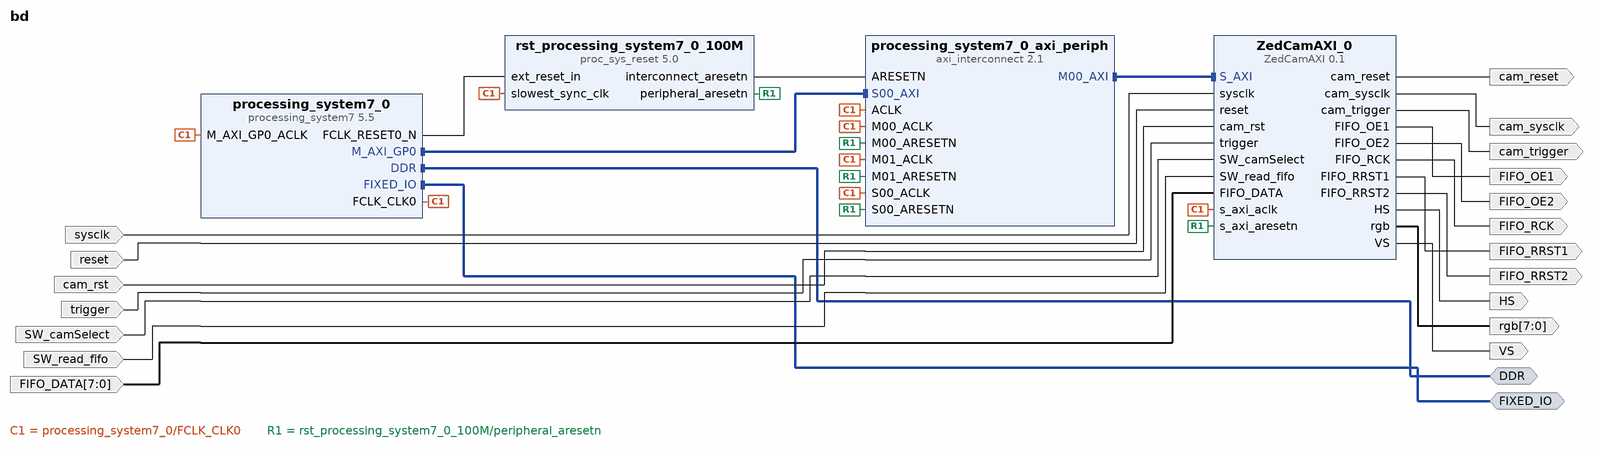
[diagram p0: block diagram of the top level]
# Vivado block design bd, Vivado 2016.2
create_bd_design bd

create_bd_intf_port -mode Master -vlnv xilinx.com:interface:ddrx_rtl:1.0 DDR
create_bd_intf_port -mode Master -vlnv xilinx.com:display_processing_system7:fixedio_rtl:1.0 FIXED_IO
create_bd_port -dir I sysclk
create_bd_port -dir I reset
create_bd_port -dir I cam_rst
create_bd_port -dir I trigger
create_bd_port -dir I SW_camSelect
create_bd_port -dir I SW_read_fifo
create_bd_port -dir I -from 7 -to 0 FIFO_DATA
create_bd_port -dir O cam_sysclk
create_bd_port -dir O cam_reset
create_bd_port -dir O cam_trigger
create_bd_port -dir O FIFO_OE1
create_bd_port -dir O FIFO_RRST1
create_bd_port -dir O FIFO_OE2
create_bd_port -dir O FIFO_RRST2
create_bd_port -dir O FIFO_RCK
create_bd_port -dir O -from 7 -to 0 rgb
create_bd_port -dir O HS
create_bd_port -dir O VS

create_bd_cell -type ip -vlnv xilinx.com:ip:processing_system7:5.5 processing_system7_0
set_property -dict [list \
  CONFIG.PCW_USE_AXI_NONSECURE 1 \
  CONFIG.PCW_QSPI_GRP_SINGLE_SS_ENABLE 1 \
  CONFIG.PCW_ENET0_PERIPHERAL_ENABLE 0 \
  CONFIG.PCW_SD0_PERIPHERAL_ENABLE 0 \
  CONFIG.PCW_USB0_PERIPHERAL_ENABLE 0 \
  CONFIG.PCW_I2C0_PERIPHERAL_ENABLE 1 \
  CONFIG.PCW_I2C0_I2C0_IO {MIO 14 .. 15} \
  CONFIG.preset ZedBoard \
] [get_bd_cells processing_system7_0]
# 4 more settings of processing_system7_0 are not shown: defaults, MIO pin electricals, DDR timing, and values the tool derives
create_bd_cell -type ip -vlnv xilinx.com:ip:axi_interconnect:2.1 processing_system7_0_axi_periph
set_property -dict {CONFIG.NUM_MI 2} [get_bd_cells processing_system7_0_axi_periph]
create_bd_cell -type ip -vlnv xilinx.com:ip:proc_sys_reset:5.0 rst_processing_system7_0_100M
create_bd_cell -type ip -vlnv xilinx.com:user:ZedCamAXI:0.1 ZedCamAXI_0

# ---- connections ----

connect_bd_intf_net [get_bd_intf_pins processing_system7_0/M_AXI_GP0] [get_bd_intf_pins processing_system7_0_axi_periph/S00_AXI]
connect_bd_intf_net [get_bd_intf_pins processing_system7_0_axi_periph/M00_AXI] [get_bd_intf_pins ZedCamAXI_0/S_AXI]
connect_bd_intf_net [get_bd_intf_ports DDR] [get_bd_intf_pins processing_system7_0/DDR]
connect_bd_intf_net [get_bd_intf_ports FIXED_IO] [get_bd_intf_pins processing_system7_0/FIXED_IO]
connect_bd_net [get_bd_pins processing_system7_0/FCLK_CLK0] \
  [get_bd_pins processing_system7_0/M_AXI_GP0_ACLK] [get_bd_pins rst_processing_system7_0_100M/slowest_sync_clk] \
  [get_bd_pins ZedCamAXI_0/s_axi_aclk] [get_bd_pins processing_system7_0_axi_periph/S00_ACLK] \
  [get_bd_pins processing_system7_0_axi_periph/ACLK] [get_bd_pins processing_system7_0_axi_periph/M00_ACLK] \
  [get_bd_pins processing_system7_0_axi_periph/M01_ACLK]
connect_bd_net [get_bd_pins processing_system7_0/FCLK_RESET0_N] [get_bd_pins rst_processing_system7_0_100M/ext_reset_in]
connect_bd_net [get_bd_pins rst_processing_system7_0_100M/peripheral_aresetn] \
  [get_bd_pins ZedCamAXI_0/s_axi_aresetn] [get_bd_pins processing_system7_0_axi_periph/S00_ARESETN] \
  [get_bd_pins processing_system7_0_axi_periph/M00_ARESETN] [get_bd_pins processing_system7_0_axi_periph/M01_ARESETN]
connect_bd_net [get_bd_pins rst_processing_system7_0_100M/interconnect_aresetn] [get_bd_pins processing_system7_0_axi_periph/ARESETN]
connect_bd_net [get_bd_ports sysclk] [get_bd_pins ZedCamAXI_0/sysclk]
connect_bd_net [get_bd_ports reset] [get_bd_pins ZedCamAXI_0/reset]
connect_bd_net [get_bd_ports cam_rst] [get_bd_pins ZedCamAXI_0/cam_rst]
connect_bd_net [get_bd_ports trigger] [get_bd_pins ZedCamAXI_0/trigger]
connect_bd_net [get_bd_ports SW_camSelect] [get_bd_pins ZedCamAXI_0/SW_camSelect]
connect_bd_net [get_bd_ports SW_read_fifo] [get_bd_pins ZedCamAXI_0/SW_read_fifo]
connect_bd_net [get_bd_ports FIFO_DATA] [get_bd_pins ZedCamAXI_0/FIFO_DATA]
connect_bd_net [get_bd_pins ZedCamAXI_0/cam_sysclk] [get_bd_ports cam_sysclk]
connect_bd_net [get_bd_pins ZedCamAXI_0/cam_reset] [get_bd_ports cam_reset]
connect_bd_net [get_bd_pins ZedCamAXI_0/cam_trigger] [get_bd_ports cam_trigger]
connect_bd_net [get_bd_pins ZedCamAXI_0/FIFO_OE1] [get_bd_ports FIFO_OE1]
connect_bd_net [get_bd_pins ZedCamAXI_0/FIFO_RRST1] [get_bd_ports FIFO_RRST1]
connect_bd_net [get_bd_pins ZedCamAXI_0/FIFO_OE2] [get_bd_ports FIFO_OE2]
connect_bd_net [get_bd_pins ZedCamAXI_0/FIFO_RRST2] [get_bd_ports FIFO_RRST2]
connect_bd_net [get_bd_pins ZedCamAXI_0/FIFO_RCK] [get_bd_ports FIFO_RCK]
connect_bd_net [get_bd_pins ZedCamAXI_0/rgb] [get_bd_ports rgb]
connect_bd_net [get_bd_pins ZedCamAXI_0/HS] [get_bd_ports HS]
connect_bd_net [get_bd_pins ZedCamAXI_0/VS] [get_bd_ports VS]

# ---- address map ----
assign_bd_address -offset 0x43C00000 -range 64K -target_address_space [get_bd_addr_spaces processing_system7_0/Data] [get_bd_addr_segs ZedCamAXI_0/S_AXI/S_AXI_reg]

validate_bd_design
save_bd_design
